# Altium schematic sheet rp-fly.SchDoc
size 209 x 297 mm; DocumentCode: Децимальный номер; SchemeType: Схема электрическая принципиальная; TitleLine1: Название проекта (строка 1); TitleLine2: Название проекта (строка 2); PageSetup: Record=PageOptionsZCenterHorizontal=TrueZCenterVertical=TrueZPrintScale=0.95ZXCorrection=1.00ZYCorrection=1.00ZPrintKind=2ZBorderSize=5000000ZLeftOffset=0ZBottomOffset=0ZOrientation=1ZPaperLength=1000ZPaperWidth=1000ZScale=100ZPaperSource=7ZPrintQuality=600ZMediaType=1ZDitherType=10ZPaperKind=A4 (210 x 297 мм)ZPrintScaleMode=1
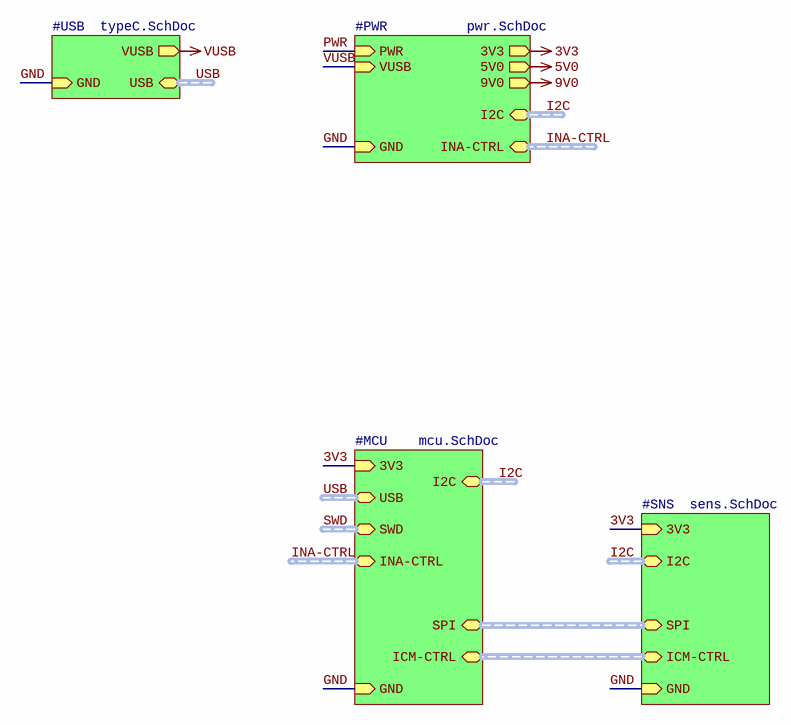
[diagram p0: rp-fly.SchDoc]

## Sub-sheets
#MCU = mcu.SchDoc: 3V3 (in), GND (in), USB (harness USB), SWD (harness SWD), I2C (harness I2C), INA-CTRL (harness INA-CTRL), SPI (harness SPI), ICM-CTRL (harness ICM-CTRL)
#PWR = pwr.SchDoc: PWR (in), VUSB (in), GND (in), 3V3 (out), 5V0 (out), I2C (harness I2C), INA-CTRL (harness INA-CTRL), 9V0 (out)
#SNS = sens.SchDoc: GND (in), 3V3 (in), I2C (harness I2C), SPI (harness SPI), ICM-CTRL (harness ICM-CTRL)
#USB = typeC.SchDoc: USB (harness USB), GND (in), VUSB (out)

## Nets
3V3: sheet #MCU/3V3, sheet #PWR/3V3, sheet #SNS/3V3
5V0: sheet #PWR/5V0
9V0: sheet #PWR/9V0
VUSB: sheet #USB/VUSB, sheet #PWR/VUSB
GND: sheet #MCU/GND, sheet #USB/GND, sheet #PWR/GND, sheet #SNS/GND
PWR: sheet #PWR/PWR

## Buses and harness runs
harness I2C = sheet #MCU/I2C
harness I2C = sheet #PWR/I2C
harness I2C = sheet #SNS/I2C
harness INA-CTRL = sheet #MCU/INA-CTRL
harness INA-CTRL = sheet #PWR/INA-CTRL
harness sheet #MCU/ICM-CTRL = sheet #SNS/ICM-CTRL
harness sheet #MCU/SPI = sheet #SNS/SPI
harness SWD = sheet #MCU/SWD
harness USB = sheet #MCU/USB
harness USB = sheet #USB/USB

## Notes on the sheet
- Перв. примен.
- Справ. №
- Подп. и дата
- Инв. № дубл.
- Взам. инв. №
- Разраб.
- Изм.
- Лист
- № докум.
- Подп.
- Дата
- Лит.
- Масса
- Масштаб
- Пров.
- Т. контр.
- Листов
- Н. контр.
- Утв.
- Нач. лаб.
- Инв. № подл.
- Копировал
- Формат А4